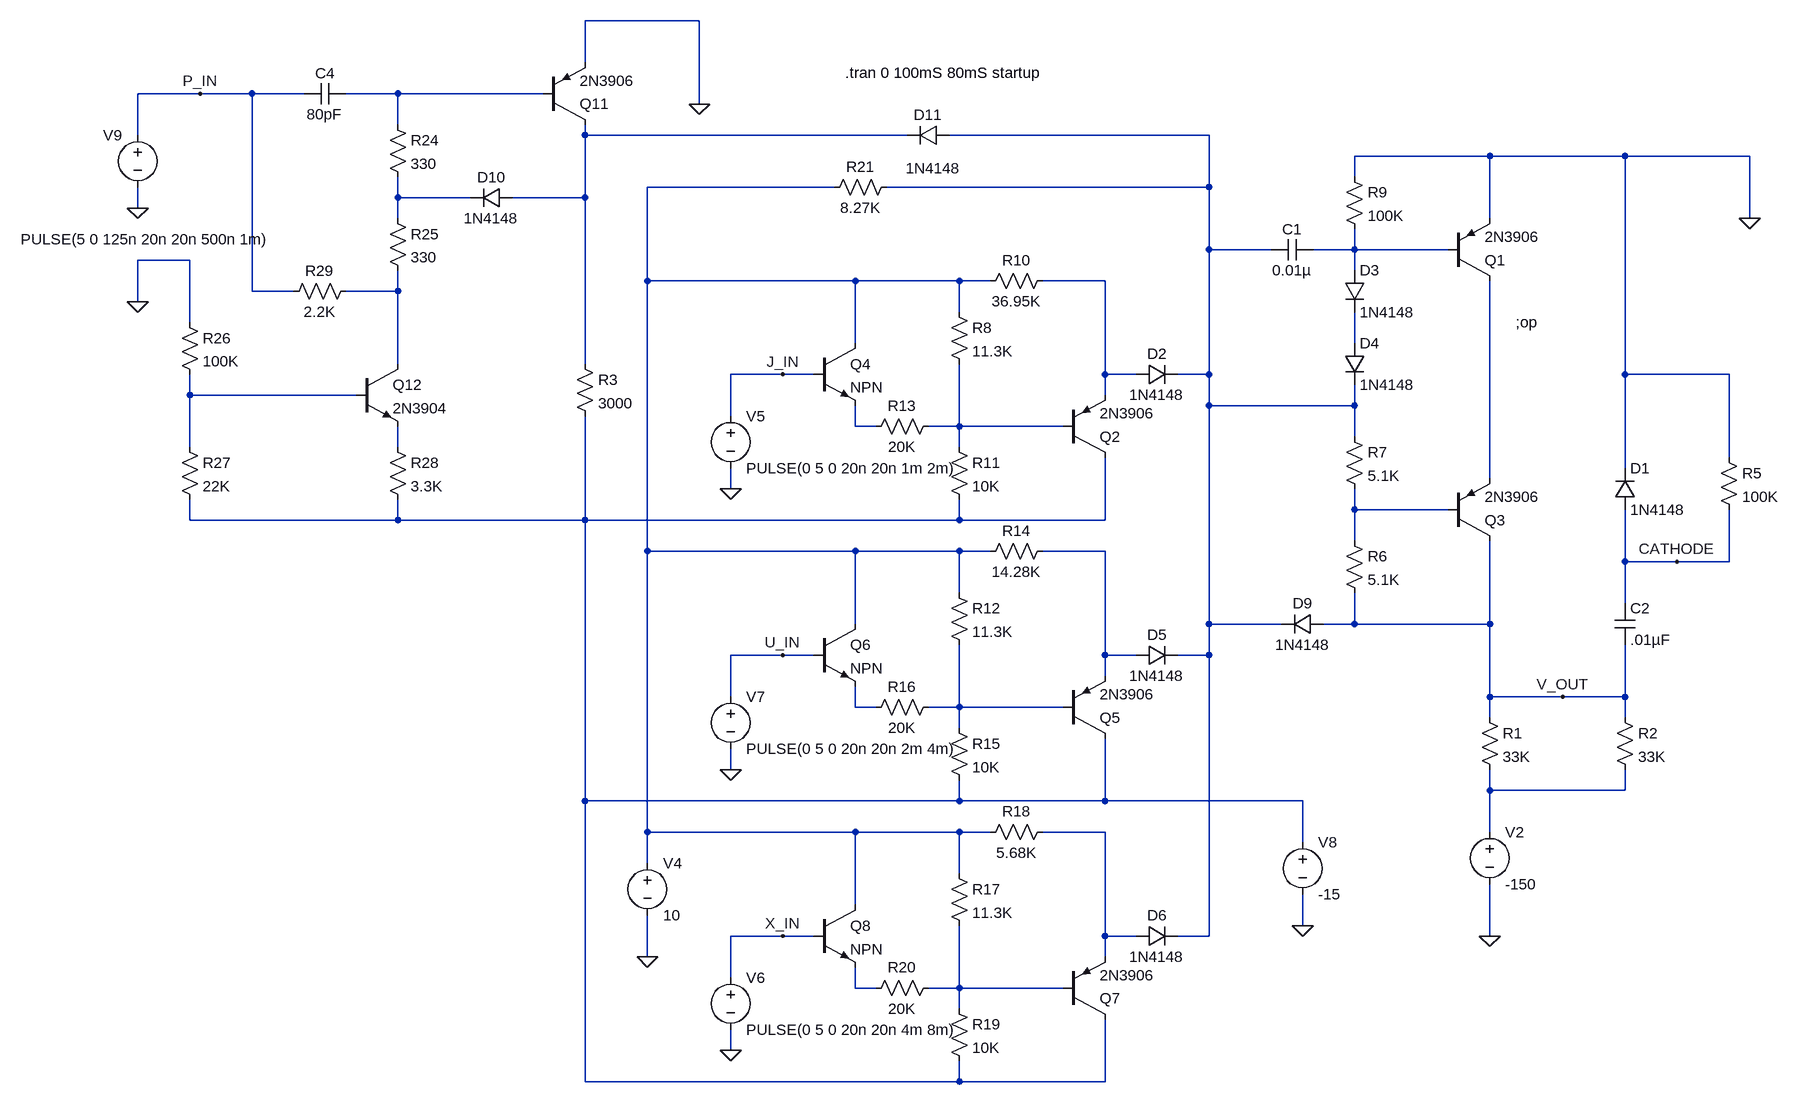
[diagram p0: schematic mimic_4688.asc]
mimic_4688.asc, the LTspice schematic file:
Version 4
SHEET 1 3296 1832
WIRE 96 -448 -80 -448
WIRE -80 -384 -80 -448
WIRE -672 -336 -768 -336
WIRE -592 -336 -672 -336
WIRE -512 -336 -592 -336
WIRE -368 -336 -448 -336
WIRE -144 -336 -368 -336
WIRE 96 -320 96 -448
WIRE -368 -288 -368 -336
WIRE -768 -272 -768 -336
WIRE -80 -272 -80 -288
WIRE 416 -272 -80 -272
WIRE 880 -272 480 -272
WIRE 1312 -240 1104 -240
WIRE 1520 -240 1312 -240
WIRE 1712 -240 1520 -240
WIRE 1104 -208 1104 -240
WIRE 304 -192 16 -192
WIRE 880 -192 880 -272
WIRE 880 -192 384 -192
WIRE -368 -176 -368 -208
WIRE -256 -176 -368 -176
WIRE -80 -176 -80 -272
WIRE -80 -176 -192 -176
WIRE -768 -160 -768 -192
WIRE -368 -144 -368 -176
WIRE 1312 -144 1312 -240
WIRE 1712 -144 1712 -240
WIRE 880 -96 880 -192
WIRE 976 -96 880 -96
WIRE 1104 -96 1104 -128
WIRE 1104 -96 1040 -96
WIRE 1248 -96 1104 -96
WIRE -688 -80 -768 -80
WIRE 1104 -64 1104 -96
WIRE 16 -48 16 -192
WIRE 336 -48 16 -48
WIRE 496 -48 336 -48
WIRE 544 -48 496 -48
WIRE 720 -48 624 -48
WIRE -592 -32 -592 -336
WIRE -528 -32 -592 -32
WIRE -368 -32 -368 -64
WIRE -368 -32 -448 -32
WIRE -768 -16 -768 -80
WIRE 496 0 496 -48
WIRE -688 16 -688 -80
WIRE 336 48 336 -48
WIRE 1104 48 1104 0
WIRE -368 80 -368 -32
WIRE -80 80 -80 -176
WIRE 224 96 144 96
WIRE 272 96 224 96
WIRE 720 96 720 -48
WIRE 768 96 720 96
WIRE 880 96 880 -96
WIRE 880 96 832 96
WIRE 1520 96 1520 -240
WIRE 1680 96 1520 96
WIRE -688 128 -688 96
WIRE -432 128 -688 128
WIRE 720 128 720 96
WIRE 880 144 880 96
WIRE 1104 144 1104 112
WIRE 1104 144 880 144
WIRE 144 160 144 96
WIRE 336 176 336 144
WIRE 368 176 336 176
WIRE 496 176 496 80
WIRE 496 176 448 176
WIRE 656 176 496 176
WIRE 1104 192 1104 144
WIRE -688 208 -688 128
WIRE -368 208 -368 176
WIRE 496 208 496 176
WIRE 1680 224 1680 96
WIRE 1520 240 1520 96
WIRE 1312 256 1312 -48
WIRE 144 272 144 240
WIRE 1104 304 1104 272
WIRE 1248 304 1104 304
WIRE -688 320 -688 288
WIRE -368 320 -368 288
WIRE -368 320 -688 320
WIRE -80 320 -80 160
WIRE -80 320 -368 320
WIRE 496 320 496 288
WIRE 496 320 -80 320
WIRE 720 320 720 224
WIRE 720 320 496 320
WIRE 1104 352 1104 304
WIRE 16 368 16 -48
WIRE 336 368 16 368
WIRE 496 368 336 368
WIRE 544 368 496 368
WIRE 720 368 624 368
WIRE 1520 384 1520 304
WIRE 1600 384 1520 384
WIRE 1680 384 1680 304
WIRE 1680 384 1600 384
WIRE 496 432 496 368
WIRE 1520 448 1520 384
WIRE 336 480 336 368
WIRE 880 480 880 144
WIRE 992 480 880 480
WIRE 1104 480 1104 432
WIRE 1104 480 1056 480
WIRE 1312 480 1312 352
WIRE 1312 480 1104 480
WIRE 224 528 144 528
WIRE 272 528 224 528
WIRE 720 528 720 368
WIRE 768 528 720 528
WIRE 880 528 880 480
WIRE 880 528 832 528
WIRE 720 560 720 528
WIRE 144 592 144 528
WIRE 1312 592 1312 480
WIRE 1424 592 1312 592
WIRE 1520 592 1520 512
WIRE 1520 592 1424 592
WIRE 336 608 336 576
WIRE 368 608 336 608
WIRE 496 608 496 512
WIRE 496 608 448 608
WIRE 656 608 496 608
WIRE 1312 624 1312 592
WIRE 1520 624 1520 592
WIRE 496 640 496 608
WIRE 144 704 144 672
WIRE 1312 736 1312 704
WIRE 1520 736 1520 704
WIRE 1520 736 1312 736
WIRE -80 752 -80 320
WIRE 496 752 496 720
WIRE 496 752 -80 752
WIRE 720 752 720 656
WIRE 720 752 496 752
WIRE 1024 752 720 752
WIRE 16 800 16 368
WIRE 336 800 16 800
WIRE 496 800 336 800
WIRE 544 800 496 800
WIRE 720 800 624 800
WIRE 1312 800 1312 736
WIRE 1024 816 1024 752
WIRE 16 848 16 800
WIRE 496 864 496 800
WIRE 336 912 336 800
WIRE 1024 944 1024 896
WIRE 224 960 144 960
WIRE 272 960 224 960
WIRE 720 960 720 800
WIRE 768 960 720 960
WIRE 880 960 880 528
WIRE 880 960 832 960
WIRE 1312 960 1312 880
WIRE 16 992 16 928
WIRE 720 992 720 960
WIRE 144 1024 144 960
WIRE 336 1040 336 1008
WIRE 368 1040 336 1040
WIRE 496 1040 496 944
WIRE 496 1040 448 1040
WIRE 656 1040 496 1040
WIRE 496 1072 496 1040
WIRE 144 1136 144 1104
WIRE -80 1184 -80 752
WIRE 496 1184 496 1152
WIRE 496 1184 -80 1184
WIRE 720 1184 720 1088
WIRE 720 1184 496 1184
FLAG 144 272 0
FLAG 144 704 0
FLAG 144 1136 0
FLAG 1312 960 0
FLAG 1712 -144 0
FLAG 1024 944 0
FLAG -768 -16 0
FLAG 96 -320 0
FLAG -768 -160 0
FLAG 1600 384 CATHODE
FLAG 16 992 0
FLAG 224 96 J_IN
FLAG 224 528 U_IN
FLAG 224 960 X_IN
FLAG 1424 592 V_OUT
FLAG -672 -336 P_IN
SYMBOL pnp 1248 -48 M180
SYMATTR InstName Q1
SYMATTR Value 2N3906
SYMBOL pnp 1248 352 M180
SYMATTR InstName Q3
SYMATTR Value 2N3906
SYMBOL res 1088 336 R0
SYMATTR InstName R6
SYMATTR Value 5.1K
SYMBOL res 1088 176 R0
SYMATTR InstName R7
SYMATTR Value 5.1K
SYMBOL diode 1088 -64 R0
SYMATTR InstName D3
SYMATTR Value 1N4148
SYMBOL diode 1088 48 R0
SYMATTR InstName D4
SYMATTR Value 1N4148
SYMBOL res 1088 -224 R0
SYMATTR InstName R9
SYMATTR Value 100K
SYMBOL pnp 656 224 M180
SYMATTR InstName Q2
SYMATTR Value 2N3906
SYMBOL res 480 -16 R0
SYMATTR InstName R8
SYMATTR Value 11.3K
SYMBOL res 528 -32 R270
WINDOW 0 32 56 VTop 2
WINDOW 3 0 56 VBottom 2
SYMATTR InstName R10
SYMATTR Value 36.95K
SYMATTR SpiceLine tol=1
SYMBOL diode 768 80 M90
WINDOW 0 0 32 VBottom 2
WINDOW 3 32 32 VTop 2
SYMATTR InstName D2
SYMATTR Value 1N4148
SYMBOL voltage 16 832 R0
WINDOW 123 0 0 Left 0
WINDOW 39 0 0 Left 0
SYMATTR InstName V4
SYMATTR Value 10
SYMBOL res 480 192 R0
SYMATTR InstName R11
SYMATTR Value 10K
SYMBOL npn 272 48 R0
SYMATTR InstName Q4
SYMBOL voltage 144 144 R0
WINDOW 123 0 0 Left 0
WINDOW 39 0 0 Left 0
SYMATTR InstName V5
SYMATTR Value PULSE(0 5 0 20n 20n 1m 2m)
SYMBOL res 464 160 R90
WINDOW 0 0 56 VBottom 2
WINDOW 3 32 56 VTop 2
SYMATTR InstName R13
SYMATTR Value 20K
SYMBOL cap 1040 -112 R90
WINDOW 0 0 32 VBottom 2
WINDOW 3 32 32 VTop 2
SYMATTR InstName C1
SYMATTR Value 0.01µ
SYMATTR SpiceLine V=16 Irms=647m Rser=0.0322889 Lser=0 mfg="KEMET" pn="C0201C103K4PAC" type="X5R"
SYMBOL pnp 656 656 M180
SYMATTR InstName Q5
SYMATTR Value 2N3906
SYMBOL res 480 416 R0
SYMATTR InstName R12
SYMATTR Value 11.3K
SYMBOL res 640 352 R90
WINDOW 0 0 56 VBottom 2
WINDOW 3 32 56 VTop 2
SYMATTR InstName R14
SYMATTR Value 14.28K
SYMATTR SpiceLine tol=1
SYMBOL diode 768 512 M90
WINDOW 0 0 32 VBottom 2
WINDOW 3 32 32 VTop 2
SYMATTR InstName D5
SYMATTR Value 1N4148
SYMBOL res 480 624 R0
SYMATTR InstName R15
SYMATTR Value 10K
SYMBOL npn 272 480 R0
SYMATTR InstName Q6
SYMBOL voltage 144 576 R0
WINDOW 123 0 0 Left 0
WINDOW 39 0 0 Left 0
SYMATTR InstName V7
SYMATTR Value PULSE(0 5 0 20n 20n 2m 4m)
SYMBOL res 464 592 R90
WINDOW 0 0 56 VBottom 2
WINDOW 3 32 56 VTop 2
SYMATTR InstName R16
SYMATTR Value 20K
SYMBOL pnp 656 1088 M180
SYMATTR InstName Q7
SYMATTR Value 2N3906
SYMBOL res 480 848 R0
SYMATTR InstName R17
SYMATTR Value 11.3K
SYMBOL res 640 784 R90
WINDOW 0 0 56 VBottom 2
WINDOW 3 32 56 VTop 2
SYMATTR InstName R18
SYMATTR Value 5.68K
SYMATTR SpiceLine tol=1
SYMBOL diode 768 944 M90
WINDOW 0 0 32 VBottom 2
WINDOW 3 32 32 VTop 2
SYMATTR InstName D6
SYMATTR Value 1N4148
SYMBOL res 480 1056 R0
SYMATTR InstName R19
SYMATTR Value 10K
SYMBOL npn 272 912 R0
SYMATTR InstName Q8
SYMBOL voltage 144 1008 R0
WINDOW 123 0 0 Left 0
WINDOW 39 0 0 Left 0
SYMATTR InstName V6
SYMATTR Value PULSE(0 5 0 20n 20n 4m 8m)
SYMBOL res 464 1024 R90
WINDOW 0 0 56 VBottom 2
WINDOW 3 32 56 VTop 2
SYMATTR InstName R20
SYMATTR Value 20K
SYMBOL res 400 -208 R90
WINDOW 0 0 56 VBottom 2
WINDOW 3 32 56 VTop 2
SYMATTR InstName R21
SYMATTR Value 8.27K
SYMBOL res 1296 608 R0
SYMATTR InstName R1
SYMATTR Value 33K
SYMBOL res 1504 608 R0
SYMATTR InstName R2
SYMATTR Value 33K
SYMBOL cap 1504 448 R0
SYMATTR InstName C2
SYMATTR Value .01µF
SYMBOL res 1664 208 R0
SYMATTR InstName R5
SYMATTR Value 100K
SYMBOL diode 1504 304 M180
WINDOW 0 24 64 Left 2
WINDOW 3 24 0 Left 2
SYMATTR InstName D1
SYMATTR Value 1N4148
SYMBOL voltage 1312 784 R0
WINDOW 123 0 0 Left 2
WINDOW 39 24 44 Left 2
SYMATTR InstName V2
SYMATTR Value -150
SYMBOL diode 1056 464 R90
WINDOW 0 0 32 VBottom 2
WINDOW 3 32 32 VTop 2
SYMATTR InstName D9
SYMATTR Value 1N4148
SYMBOL pnp -144 -288 M180
SYMATTR InstName Q11
SYMATTR Value 2N3906
SYMBOL res -384 -304 R0
SYMATTR InstName R24
SYMATTR Value 330
SYMBOL res -384 -160 R0
SYMATTR InstName R25
SYMATTR Value 330
SYMBOL res -704 0 R0
SYMATTR InstName R26
SYMATTR Value 100K
SYMBOL res -704 192 R0
SYMATTR InstName R27
SYMATTR Value 22K
SYMBOL npn -432 80 R0
SYMATTR InstName Q12
SYMATTR Value 2N3904
SYMBOL voltage 1024 800 R0
WINDOW 123 0 0 Left 2
WINDOW 39 0 0 Left 2
SYMATTR InstName V8
SYMATTR Value -15
SYMBOL res -384 192 R0
SYMATTR InstName R28
SYMATTR Value 3.3K
SYMBOL res -432 -48 R90
WINDOW 0 0 56 VBottom 2
WINDOW 3 32 56 VTop 2
SYMATTR InstName R29
SYMATTR Value 2.2K
SYMBOL cap -448 -352 R90
WINDOW 0 0 32 VBottom 2
WINDOW 3 32 32 VTop 2
SYMATTR InstName C4
SYMATTR Value 80pF
SYMBOL diode -192 -192 R90
WINDOW 0 0 32 VBottom 2
WINDOW 3 32 32 VTop 2
SYMATTR InstName D10
SYMATTR Value 1N4148
SYMBOL diode 480 -288 R90
WINDOW 0 0 32 VBottom 2
WINDOW 3 51 24 VTop 2
SYMATTR InstName D11
SYMATTR Value 1N4148
SYMBOL voltage -768 -288 M0
WINDOW 123 0 0 Left 2
WINDOW 39 0 0 Left 2
WINDOW 3 180 176 Right 2
SYMATTR InstName V9
SYMATTR Value PULSE(5 0 125n 20n 20n 500n 1m)
SYMBOL res -96 64 R0
SYMATTR InstName R3
SYMATTR Value 3000
TEXT 1352 16 Left 2 !;op
TEXT 320 -368 Left 2 !.tran 0 100mS 80mS startup

The netlist it stands for:
* mimic_4688.asc
Q1 N014 N006 0 0 2N3906
Q3 V_OUT N015 N014 0 2N3906
R6 N015 V_OUT 5.1K
R7 N003 N015 5.1K
D3 N006 N009 1N4148
D4 N009 N003 1N4148
R9 0 N006 100K
Q2 N016 N012 N007 0 2N3906
R8 N004 N012 11.3K
R10 N004 N007 36.95K tol=1
D2 N007 N003 1N4148
V4 N004 0 10
R11 N012 N016 10K
Q4 N004 J_IN N011 0 NPN
V5 J_IN 0 PULSE(0 5 0 20n 20n 1m 2m)
R13 N012 N011 20K
C1 N006 N003 0.01µ V=16 Irms=647m Rser=0.0322889 Lser=0 mfg="KEMET" pn="C0201C103K4PAC" type="X5R"
Q5 N016 N019 N017 0 2N3906
R12 N004 N019 11.3K
R14 N017 N004 14.28K tol=1
D5 N017 N003 1N4148
R15 N019 N016 10K
Q6 N004 U_IN N018 0 NPN
V7 U_IN 0 PULSE(0 5 0 20n 20n 2m 4m)
R16 N019 N018 20K
Q7 N016 N023 N021 0 2N3906
R17 N004 N023 11.3K
R18 N021 N004 5.68K tol=1
D6 N021 N003 1N4148
R19 N023 N016 10K
Q8 N004 X_IN N022 0 NPN
V6 X_IN 0 PULSE(0 5 0 20n 20n 4m 8m)
R20 N023 N022 20K
R21 N003 N004 8.27K
R1 V_OUT N020 33K
R2 V_OUT N020 33K
C2 CATHODE V_OUT .01µF
R5 0 CATHODE 100K
D1 CATHODE 0 1N4148
V2 N020 0 -150
D9 V_OUT N003 1N4148
Q11 N002 N001 0 0 2N3906
R24 N001 N005 330
R25 N005 N008 330
R26 0 N010 100K
R27 N010 N016 22K
Q12 N008 N010 N013 0 2N3904
V8 N016 0 -15
R28 N013 N016 3.3K
R29 N008 P_IN 2.2K
C4 N001 P_IN 80pF
D10 N002 N005 1N4148
D11 N003 N002 1N4148
V9 P_IN 0 PULSE(5 0 125n 20n 20n 500n 1m)
R3 N002 N016 3000
.model D D
.lib standard.dio
.model NPN NPN
.model PNP PNP
.lib standard.bjt
;op
.tran 0 100mS 80mS startup
.backanno
.end